# Altium schematic sheet LED_String_NF2W757GT-F1.SchDoc: STB Light Board - 5000K String
size A4; Author: flmoll; DrawnBy: flmoll; Organization: PBL; Revision: A; SheetNumber: 8; SheetTotal: 20
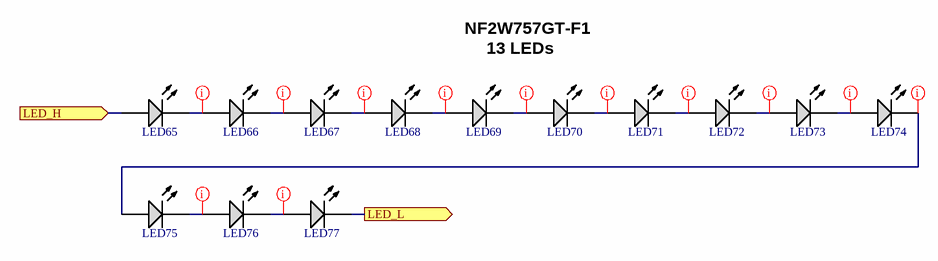
[diagram p0: LED_String_NF2W757GT-F1.SchDoc]

## Parts
LED65  NF2W757GT-F1  [NF2W757GT-F1]  (value not drawn)
LED66  NF2W757GT-F1  [NF2W757GT-F1]  (value not drawn)
LED67  NF2W757GT-F1  [NF2W757GT-F1]  (value not drawn)
LED68  NF2W757GT-F1  [NF2W757GT-F1]  (value not drawn)
LED69  NF2W757GT-F1  [NF2W757GT-F1]  (value not drawn)
LED70  NF2W757GT-F1  [NF2W757GT-F1]  (value not drawn)
LED71  NF2W757GT-F1  [NF2W757GT-F1]  (value not drawn)
LED72  NF2W757GT-F1  [NF2W757GT-F1]  (value not drawn)
LED73  NF2W757GT-F1  [NF2W757GT-F1]  (value not drawn)
LED74  NF2W757GT-F1  [NF2W757GT-F1]  (value not drawn)
LED75  NF2W757GT-F1  [NF2W757GT-F1]  (value not drawn)
LED76  NF2W757GT-F1  [NF2W757GT-F1]  (value not drawn)
LED77  NF2W757GT-F1  [NF2W757GT-F1]  (value not drawn)

## Ports
LED_H (in, see LED_Driver_NF2W757GT-F1[2A]), LED_L (out, see LED_Driver_NF2W757GT-F1[2A])

## Nets
LED_H: LED65.2(A) ; port LED_H
LED_L: LED77.1(K) ; port LED_L
NetLED65_1: LED65.1(K) LED66.2(A)
NetLED66_1: LED66.1(K) LED67.2(A)
NetLED67_1: LED67.1(K) LED68.2(A)
NetLED68_1: LED68.1(K) LED69.2(A)
NetLED69_1: LED69.1(K) LED70.2(A)
NetLED70_1: LED70.1(K) LED71.2(A)
NetLED71_1: LED71.1(K) LED72.2(A)
NetLED72_1: LED72.1(K) LED73.2(A)
NetLED73_1: LED73.1(K) LED74.2(A)
NetLED74_1: LED74.1(K) LED75.2(A)
NetLED75_1: LED75.1(K) LED76.2(A)
NetLED76_1: LED76.1(K) LED77.2(A)

## Layout directives
net class LED: NetLED65_1, NetLED66_1, NetLED67_1, NetLED68_1, NetLED69_1, NetLED70_1, NetLED71_1, NetLED72_1, NetLED73_1, NetLED74_1, NetLED75_1, NetLED76_1

## Notes on the sheet
- NF2W757GT-F1
- 13 LEDs
- 1
- 2
- 3
- 4
- A
- B
- C
- Project:
- D
- Date:
- Drawing number:
- Rev:
- Format:
- A4 Q
- Drawn by:
- Laboratory:
- Page
- Sheet:
- of
- File:

## Library data of the parts
LED65-LED77 = CMP-02058-1: SMD LED White 3,3 V, 42,8 lm 3030 (1212); Manufacturer: Nichia; Optoelectronic Device Type: SINGLE COLOR LED; Vf: 3.3 V; Intensity: 42.8 lm; REACH SVHC: No SVHC; RoHS Compliant: Yes; Color: White; Manufacturer Part Number: NF2W757GT-F1